# EAGLE design Ninja2 (EAGLE 5.11)
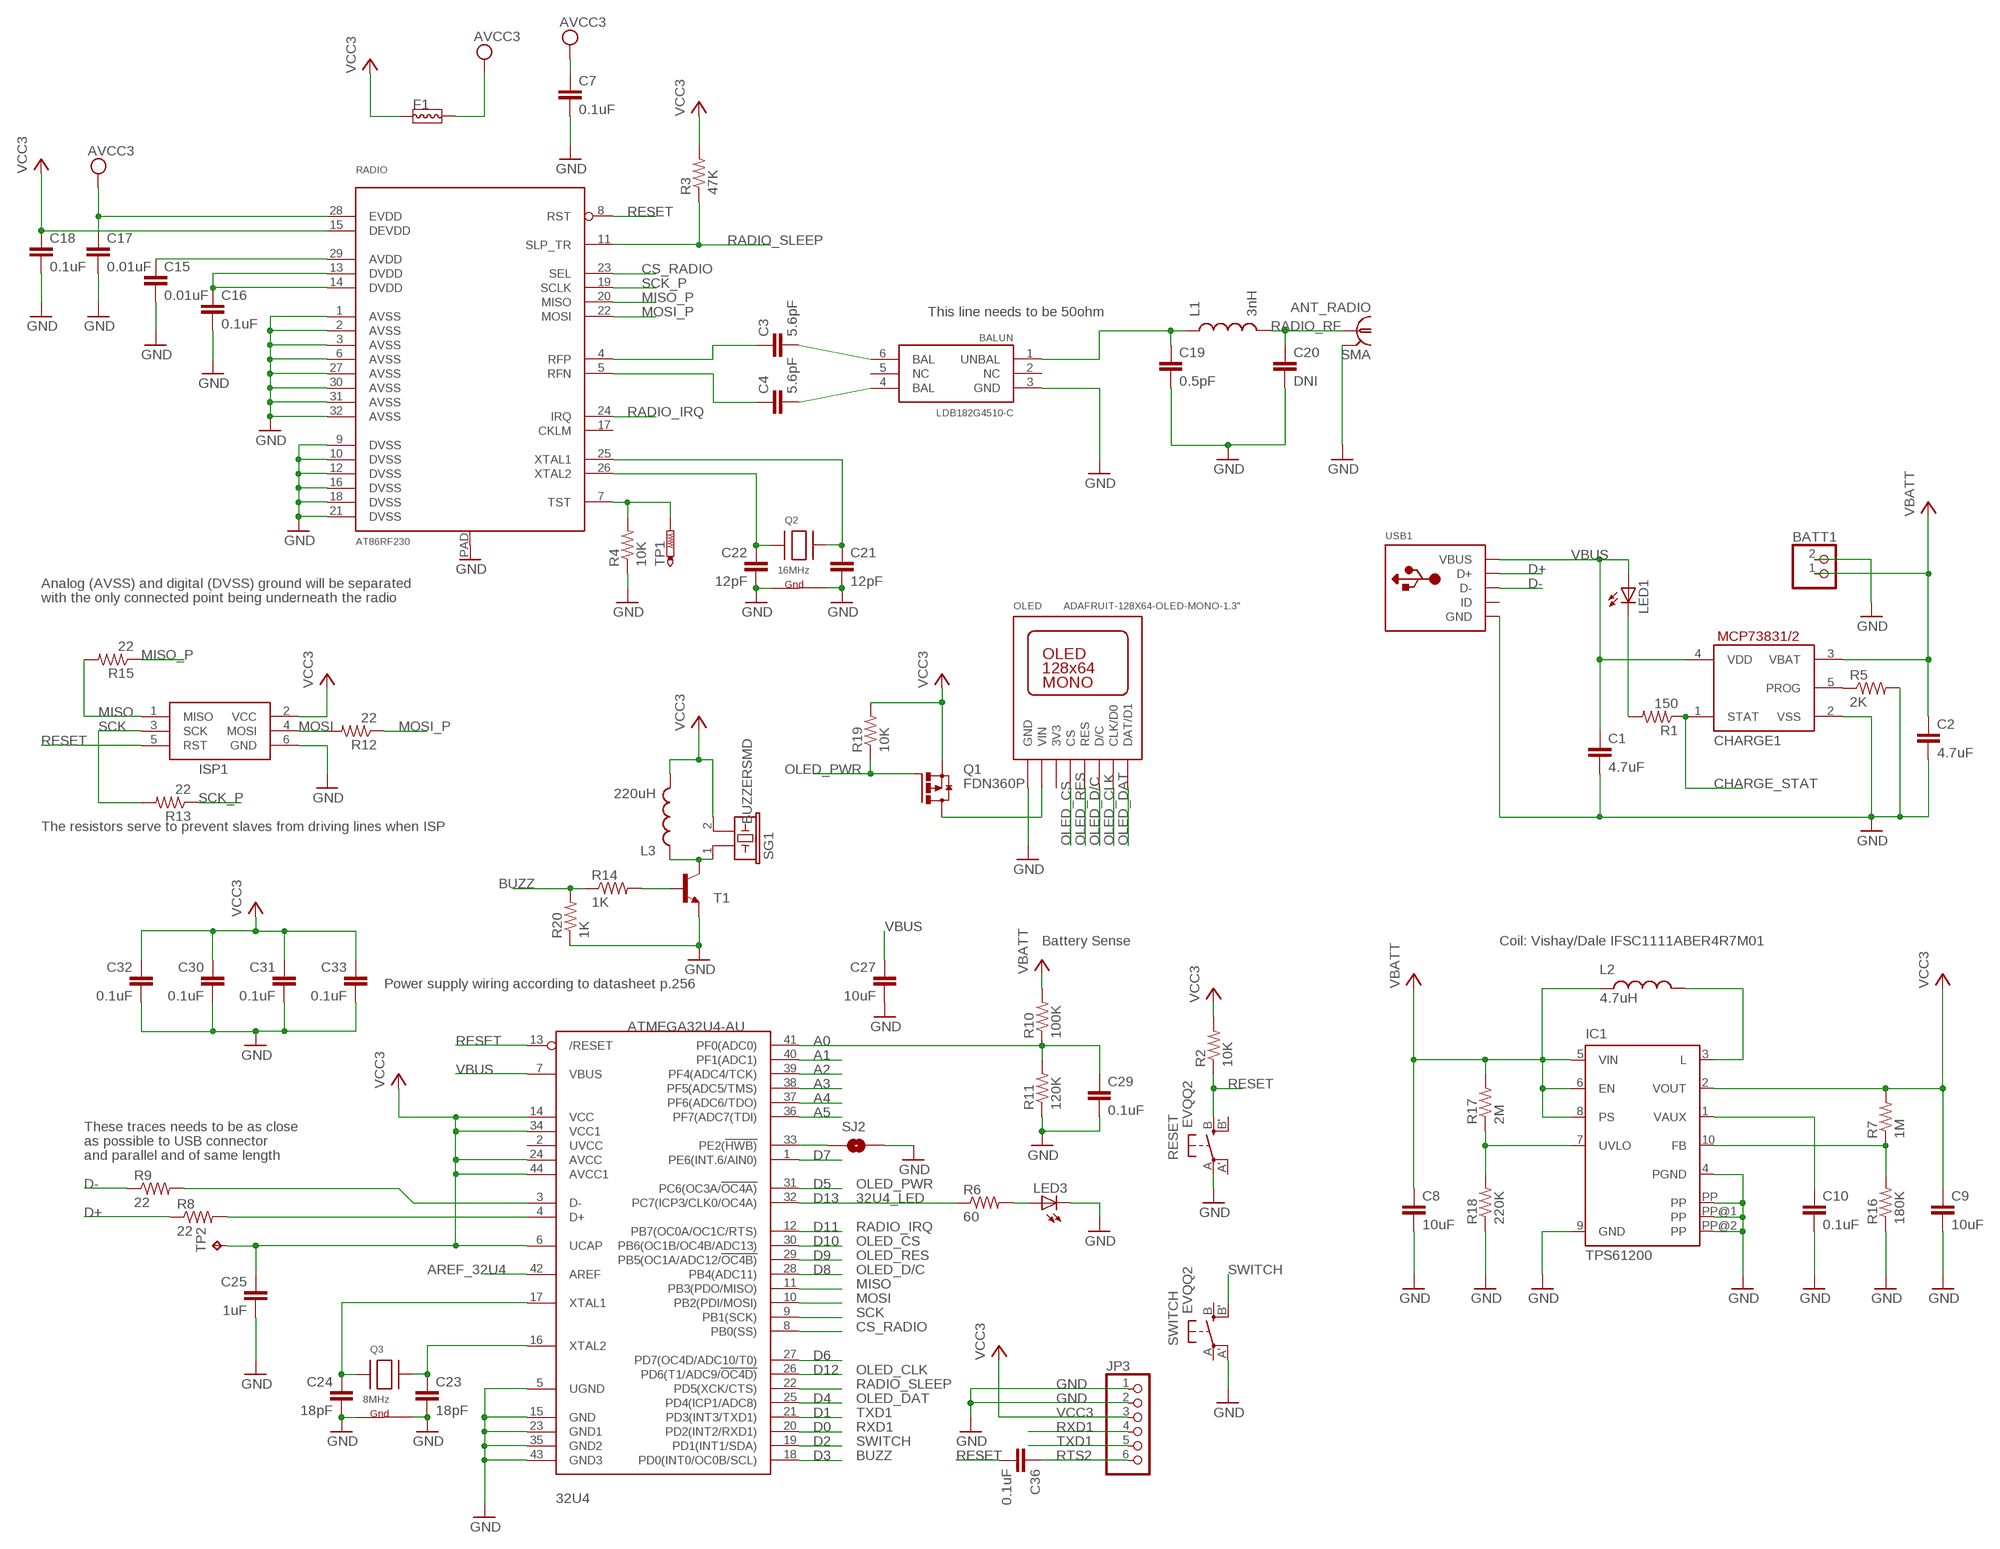
[diagram p0: schematic, sheet 1]

## Parts
32U4  ATMEGA32U4-AU  [TQFP44]
ANT_RADIO  SMA  LTI-SASF54GT  [LTI-SASF54GT]
BALUN  LDB182G4510-C  [LDB182G4510-C]
BATT1  JST_2PIN-THM  [JST-PH-2-THM]
C1  4.7uF  CAP0805  [0805]
C2  4.7uF  CAP0805  [0805]
C3  5.6pF  CAP0402-CAP  [0402-CAP]
C4  5.6pF  CAP0402-CAP  [0402-CAP]
C7  0.1uF  CAP0603-CAP  [0603-CAP]
C8  10uF  CAP0805  [0805]
C9  10uF  CAP0805  [0805]
C10  0.1uF  CAP0603-CAP  [0603-CAP]
C15  0.01uF  CAP0603-CAP  [0603-CAP]
C16  0.1uF  CAP0603-CAP  [0603-CAP]
C17  0.01uF  CAP0603-CAP  [0603-CAP]
C18  0.1uF  CAP0603-CAP  [0603-CAP]
C19  0.5pF  CAP0402-CAP  [0402-CAP]
C20  DNI  CAP0402-CAP  [0402-CAP]
C21  12pF  CAP0603-CAP  [0603-CAP]
C22  12pF  CAP0603-CAP  [0603-CAP]
C23  18pF  CAP0603-CAP  [0603-CAP]
C24  18pF  CAP0603-CAP  [0603-CAP]
C25  1uF  CAP0603-CAP  [0603-CAP]
C27  10uF  CAP0805  [0805]
C29  0.1uF  CAP0603-CAP  [0603-CAP]
C30  0.1uF  CAP0603-CAP  [0603-CAP]
C31  0.1uF  CAP0603-CAP  [0603-CAP]
C32  0.1uF  CAP0603-CAP  [0603-CAP]
C33  0.1uF  CAP0603-CAP  [0603-CAP]
C36  0.1uF  CAP0603-CAP  [0603-CAP]
CHARGE1  MCP73831/OT  [SOT23-5L]
F1  L-FERRITE-BEAD-0805  [0805]
IC1  TPS61200  [S-PDSO-N10]
ISP1  AVRISP-6  [AVRISP]
JP3  PINHD-1X6  [1X06]
L1  3nH  INDUCTOR0402  [C0402]
L2  4.7uH  INDUCTOR  [IFSC-1111AB-01]
L3  220uH  INDUCTOR1007  [1007]
LED1  LEDCHIPLED_0603  [CHIPLED_0603]
LED3  LEDCHIPLED_0603  [CHIPLED_0603]
OLED  ADAFRUIT-128X64-OLED-MONO-1.3"  [ADAFRUIT-128X64-OLED-MONO-1.3"]
Q1  FDN360P  [SUPER-SOT3]
Q2  16MHz  XTAL-4-3225  [NX3225]
Q3  8MHz  XTAL-4  [CRYSTAL-5032]
R1  150  R-US_R0805  [R0805]
R2  10K  R-US_R0603  [R0603]
R3  47K  R-US_R0603  [R0603]
R4  10K  R-US_R0603  [R0603]
R5  2K  R-US_R0603  [R0603]
R6  60  R-US_R0805  [R0805]
R7  1M  R-US_R0603  [R0603]
R8  22  R-US_R0603  [R0603]
R9  22  R-US_R0603  [R0603]
R10  100K  R-US_R0603  [R0603]
R11  120K  R-US_R0603  [R0603]
R12  22  R-US_R0603  [R0603]
R13  22  R-US_R0603  [R0603]
R14  1K  R-US_R0603  [R0603]
R15  22  R-US_R0603  [R0603]
R16  180K  R-US_R0603  [R0603]
R17  2M  R-US_R0603  [R0603]
R18  220K  R-US_R0603  [R0603]
R19  10K  R-US_R0603  [R0603]
R20  1K  R-US_R0603  [R0603]
RADIO  AT86RF230  [32QN1]
RESET  EVQQ2  [EVQ-Q2]
SG1  BUZZERSMD  [KOBITONE-254-PB501-ROX]
SJ2  SOLDERJUMPERTRACE  [SJ_2S-TRACE]
SWITCH  EVQQ2  [EVQ-Q2]
T1  BC849-NPN-SOT23-BEC  [SOT23-BEC]
TP1  PTR1B1,27  [B1,27]
TP2  TPTP15SQ  [TP15SQ]
USB1  USBMINIB  [USB-MINIB]

## Nets
32U4_LED: 32U4.32(PC7(ICP3/CLK0/OC4A)) R6.1
A1: 32U4.40(PF1(ADC1))
AREF_32U4: 32U4.42(AREF)
AVCC3: C7.1 C17.1 F1.2 RADIO.28(EVDD)
BATT_SENSE: 32U4.41(PF0(ADC0)) C29.1 R10.1 R11.2
BUZZ: 32U4.18(PD0(INT0/OC0B/SCL)) R14.1 R20.2
CHARGE_STAT: CHARGE1.1(STAT) R1.1
CS_RADIO: 32U4.8(PB0(SS)) RADIO.23(SEL)
D6: 32U4.27(PD7(OC4D/ADC10/T0))
D+: R8.1 USB1.D+
D-: R9.1 USB1.D-
GND: 32U4.5(UGND) 32U4.15(GND) 32U4.23(GND1) 32U4.35(GND2) 32U4.43(GND3) ANT_RADIO.2(GND) BALUN.3(GND) BATT1.2 C1.2 C2.2 C7.2 C8.2 C9.2 C10.2 C15.2 C16.2 C17.2 C18.2 C19.2 C20.2 C21.2 C22.2 C23.2 C24.2 C25.2 C27.2 C29.2 C30.2 C31.2 C32.2 C33.2 CHARGE1.2(VSS) IC1.4(PGND) IC1.9(GND) IC1.PP IC1.PP@1(PP) IC1.PP@2(PP) ISP1.6(GND) JP3.1 JP3.2 LED3.C OLED.GND Q2.2(G2) Q2.4(G1) Q3.2(G1) Q3.4(G2) R4.1 R5.2 R11.1 R16.1 R18.1 R20.1 RADIO.1(AVSS) RADIO.2(AVSS) RADIO.3(AVSS) RADIO.6(AVSS) RADIO.9(DVSS) RADIO.10(DVSS) RADIO.12(DVSS) RADIO.16(DVSS) RADIO.18(DVSS) RADIO.21(DVSS) RADIO.27(AVSS) RADIO.30(AVSS) RADIO.31(AVSS) RADIO.32(AVSS) RADIO.PAD RESET.A(P) SJ2.2 SWITCH.A'(P1) T1.E USB1.GND
MISO: 32U4.11(PB3(PDO/MISO)) ISP1.1(MISO) R15.2
MISO_P: R15.1 RADIO.20(MISO)
MOSI: 32U4.10(PB2(PDI/MOSI)) ISP1.4(MOSI) R12.2
MOSI_P: R12.1 RADIO.22(MOSI)
N$1: 32U4.16(XTAL2) C23.1 Q3.3(X2)
N$2: LED1.C R1.2
N$3: C10.1 IC1.1(VAUX)
N$4: CHARGE1.5(PROG) R5.1
N$5: BALUN.4(BAL) C4.2
N$6: IC1.7(UVLO) R17.1 R18.2
N$7: L3.1 SG1.1 T1.C
N$8: C16.1 RADIO.13(DVDD) RADIO.14(DVDD)
N$9: C15.1 RADIO.29(AVDD)
N$10: IC1.10(FB) R7.1 R16.2
N$11: IC1.3(L) L2.2
N$12: C21.1 Q2.3(X2) RADIO.25(XTAL1)
N$13: C22.1 Q2.1(X1) RADIO.26(XTAL2)
N$14: OLED.VIN Q1.3(D)
N$15: R14.2 T1.B
N$16: LED3.A R6.2
N$17: R4.2 RADIO.7(TST) TP1.TP
N$18: BALUN.6(BAL) C3.2
N$19: C4.1 RADIO.5(RFN)
N$20: C3.1 RADIO.4(RFP)
N$21: BALUN.1(UNBAL) C19.1 L1.1
N$22: 32U4.36(PF7(ADC7(TDI))
N$24: 32U4.17(XTAL1) C24.1 Q3.1(X1)
N$27: 32U4.3(D-) R9.2
N$28: 32U4.4(D+) R8.2
N$29: 32U4.39(PF4(ADC4/TCK))
N$30: 32U4.38(PF5(ADC5/TMS))
N$31: 32U4.37(PF6(ADC6/TDO))
N$32: 32U4.33(PE2(!HWB)) SJ2.1
N$34: 32U4.1(PE6(INT.6/AIN0))
OLED_CLK: 32U4.26(PD6(T1/ADC9/!OC4D)) OLED.CLK(CLK/D0)
OLED_CS: 32U4.30(PB6(OC1B/OC4B/ADC13)) OLED.CS
OLED_D/C: 32U4.28(PB4(ADC11)) OLED.DC(D/C)
OLED_DAT: 32U4.25(PD4(ICP1/ADC8)) OLED.DATA(DAT/D1)
OLED_PWR: 32U4.31(PC6(OC3A/!OC4A)) Q1.1(G) R19.1
OLED_RES: 32U4.29(PB5(OC1A/ADC12/!OC4B)) OLED.RST(RES)
RADIO_IRQ: 32U4.12(PB7(OC0A/OC1C/RTS)) RADIO.24(IRQ)
RADIO_RF: ANT_RADIO.1 C20.1 L1.2
RADIO_SLEEP: 32U4.22(PD5(XCK/CTS)) R3.1 RADIO.11(SLP_TR)
RESET: 32U4.13(/RESET) C36.2 ISP1.5(RST) R2.1 RADIO.8(RST) RESET.B(S)
RTS2: C36.1 JP3.6
RXD1: 32U4.20(PD2(INT2/RXD1)) JP3.4
SCK: 32U4.9(PB1(SCK)) ISP1.3(SCK) R13.2
SCK_P: R13.1 RADIO.19(SCLK)
SWITCH: 32U4.19(PD1(INT1/SDA)) SWITCH.B'(S1)
TXD1: 32U4.21(PD3(INT3/TXD1)) JP3.5
VBATT: BATT1.1 C2.1 C8.1 CHARGE1.3(VBAT) IC1.5(VIN) IC1.6(EN) IC1.8(PS) L2.1 R10.2 R17.2
VBUS: 32U4.7(VBUS) C1.1 C27.1 CHARGE1.4(VDD) LED1.A USB1.VBUS
VCC3: 32U4.6(UCAP) 32U4.14(VCC) 32U4.24(AVCC) 32U4.34(VCC1) 32U4.44(AVCC1) C9.1 C18.1 C25.1 C30.1 C31.1 C32.1 C33.1 F1.1 IC1.2(VOUT) ISP1.2(VCC) JP3.3 L3.2 Q1.2(S) R2.2 R3.2 R7.2 R19.2 RADIO.15(DEVDD) SG1.2 TP2.TP
Unconnected: 32U4.2(UVCC) BALUN.2(NC) BALUN.5(NC) OLED.3V3 RADIO.17(CKLM) RESET.A'(P1) RESET.B'(S1) SWITCH.A(P) SWITCH.B(S) USB1.ID

## Notes on the sheet
- This line needs to be 50ohm
- Analog (AVSS) and digital (DVSS) ground will be separated
- with the only connected point being underneath the radio
- The resistors serve to prevent slaves from driving lines when ISP
- Battery Sense | Coil: Vishay/Dale IFSC1111ABER4R7M01
- Power supply wiring according to datasheet p.256
- A0
- A1
- A2
- A3
- A4
- A5
- These traces needs to be as close
- as possible to USB connector
- and parallel and of same length | D7
- D5
- D13
- D11
- D10
- D9
- D8
- D6
- D12
- D4
- D1
- D0
- D2
- D3

## Power pins joined to a net without a drawn wire
GND: ANT_RADIO.3(GND) ANT_RADIO.4(GND) ANT_RADIO.5(GND)

## Library data of the parts
32U4 = adafruit:ATMEGA32U4: http://www.ladyada.net/library/eagle
ANT_RADIO = con-coax:LTI-SASF54GT: SMA vertical PCB thrue hole jack Source: Lighthorse Technologies, inc. SASF54GT.pdf; OC_FARNELL: unknown; OC_NEWARK: unknown
BALUN = Robin:LDB182G4510-C
BATT1 = adafruit:JST_2PIN: JST 2-Pin Connectors of various flavors SMT-RA (S2B-PH-SM4) 4UConnector #17311 SMT (B2B-PH-SM4) THM-RA (S2B-PH) THM (B2B-PH)
C1-C4 C7-C10 C15-C25 C27 C29-C33 C36 = SparkFun:CAP: Capacitor Standard 0603 ceramic capacitor, and 0.1" leaded capacitor.
CHARGE1 = adafruit:MCP73831: MCP73831/2 Miniature Single-Cell, Fully Integrated Li-Ion, Li-Polymer Charge Management Controllers. Nice and small simple lipoly charge controller, with adjustable current and status output (LED) http://www.ladyada.net/library/pcb/eaglelibrary.html
F1 = Discreter:L-FERRITE-BEAD
IC1 = texas:TPS6120*: LOW INPUT VOLTAGE SYNCHRONOUS BOOST CONVERTER WITH 1.3-A SWITCHES Source: http://focus.ti.com/lit/ds/symlink/tps61200.pdf; MPN: TPS61200DRCT; OC_FARNELL: 1471238; OC_NEWARK: 37M0066
ISP1 = adafruit:AVRISP: AVR ISP HEADER Standard 6 pin header for AVR programming
JP3 = pinhead:PINHD-1X6: PIN HEADER
L1 L3 = SparkFun:INDUCTOR: Inductors Basic Inductor/Choke - 0603 and 1206. Footprints are not proven and vary greatly between part numbers.
L2 = Robin:INDUCTOR
LED1 LED3 = adafruit:LED: LED OSRAM: - CHIPLED LG R971, LG N971, LY N971, LG Q971, LY Q971, LO R971, LY R971 LH N974, LH R974 LS Q976, LO Q976, LY Q976 LO Q996 - Hyper CHIPLED LW Q18S LB Q993, LB Q99A, LB R99A - SideLED LS A670, LO A670, LY A670, LG A670, LP A670 LB A673, LV A673, LT A673, LW A673 LH A674 LY A675 LS A676, LA A676, LO A676, LY A676, LW A676 LS A679, LY A679, LG A679 - Hyper Micro SIDELED® LS Y876, LA Y876, LO Y876, LY Y876 LT Y87S - SmartLED LW L88C, LW L88S LB L89C, LB L89S, LG L890 LS L89K, LO L89K, LY L89K LS L896, LA L896, LO L896, LY L896 - TOPLED LS T670, LO T670, LY T670, LG T670, LP T670 LSG T670, LSP T670, LSY T670, LOP T670, LYG T670 LG T671, LOG T671, LSG T671 LB T673, LV T673, LT T673, LW T673 LH T674 LS T676, LA T676, LO T676, LY T676, LB T676, LH T676, LSB T676, LW T676 LB T67C, LV T67C, LT T67C, LS T67K, LO T67K, LY T67K, LW E67C LS E67B, LA E67B, LO E67B, LY E67B, LB E67C, LV E67C, LT E67C LW T67C LS T679, LY T679, LG T679 LS T770, LO T770, LY T770, LG T770, LP T770 LB T773, LV T773, LT T773, LW T773 LH T774 LS E675, LA E675, LY E675, LS T675 LS T776, LA T776, LO T776, LY T776, LB T776 LHGB T686 LT T68C, LB T68C - Hyper Mini TOPLED® LB M676 - Mini TOPLED Santana® LG M470 LS M47K, LO M47K, LY M47K Source: http://www.osram.convergy.de/
OLED = Robin:ADAFRUIT-128X64-OLED-MONO-1.3"
Q1 = transistor-power:FDN360P: Single P-Channel, PowerTrench (R) MOSFET Source: http://www.fairchildsemi.com/ds/FD/FDN360P.pdf
Q2 = adafruit:XTAL-4: Classic 4-pin 3.2 x 2.5mm crystal
Q3 = Robin:XTAL-4
R1-R20 = adafruit:R-US_: RESISTOR, American symbol
RADIO = Robin:AT86RF230
RESET SWITCH = adafruit:EVQQ2: SMT 6mm switch, EVQQ2 series http://www.ladyada.net/library/eagle
SG1 = Robin:BUZZER: BUZZER Source: muRata
SJ2 = SparkFun:SOLDERJUMPER: Solder Jumper Standard SMD solder jumper. Used to automate production. Two varients : Normally Open and Normally Closed are the same, but have different paste layers. NC will have a large amount of paste and should jumper during reflow.
T1 = transistor:*-NPN-: NPN Transistror BF959 corrected 2008.03.06
TP1 = testpad:PTR1: TEST PIN
TP2 = testpad:TP: Test pad
USB1 = adafruit:USB: USB Connectors USBMINIB - Surface Mount Female Mini-B USB Connector 4UConnector: 06564 By microbuilder.eu Thru-hole RA Female Mini-B USB Connector 4UConnector: 18732 By ladyada.net

## Board
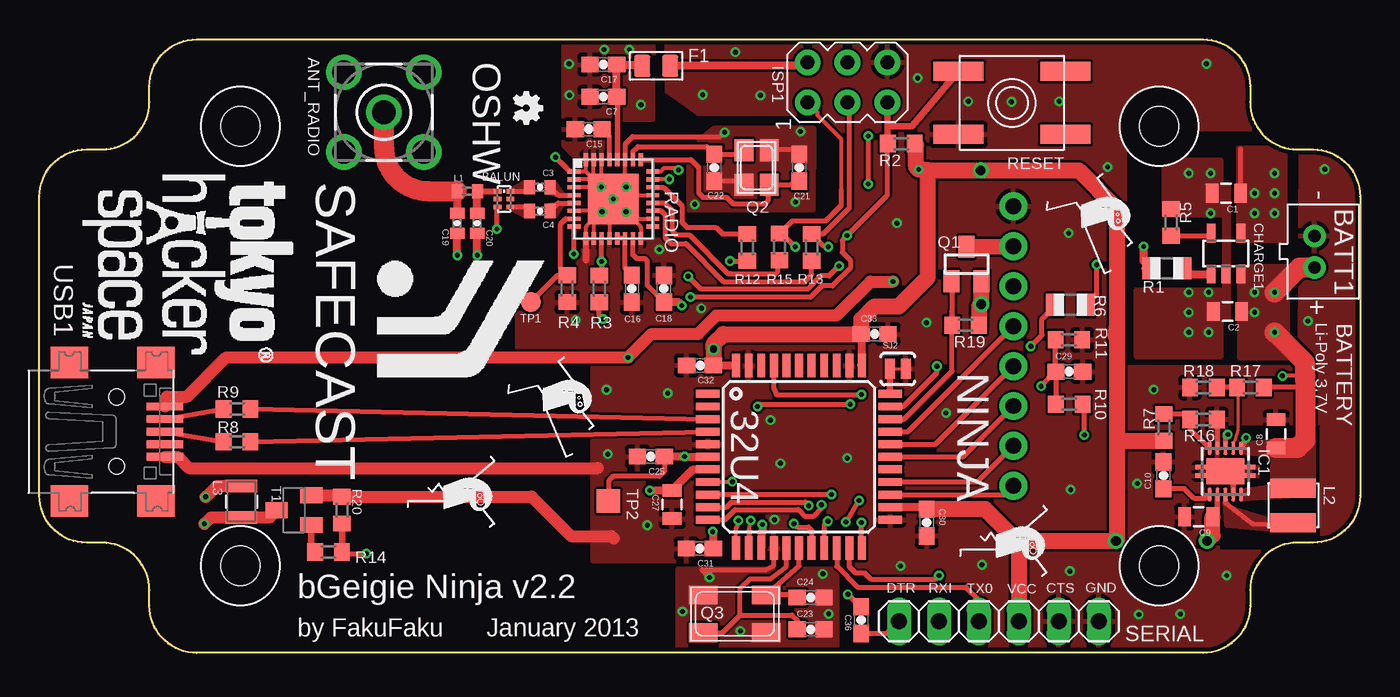
[diagram p1: board, top side]
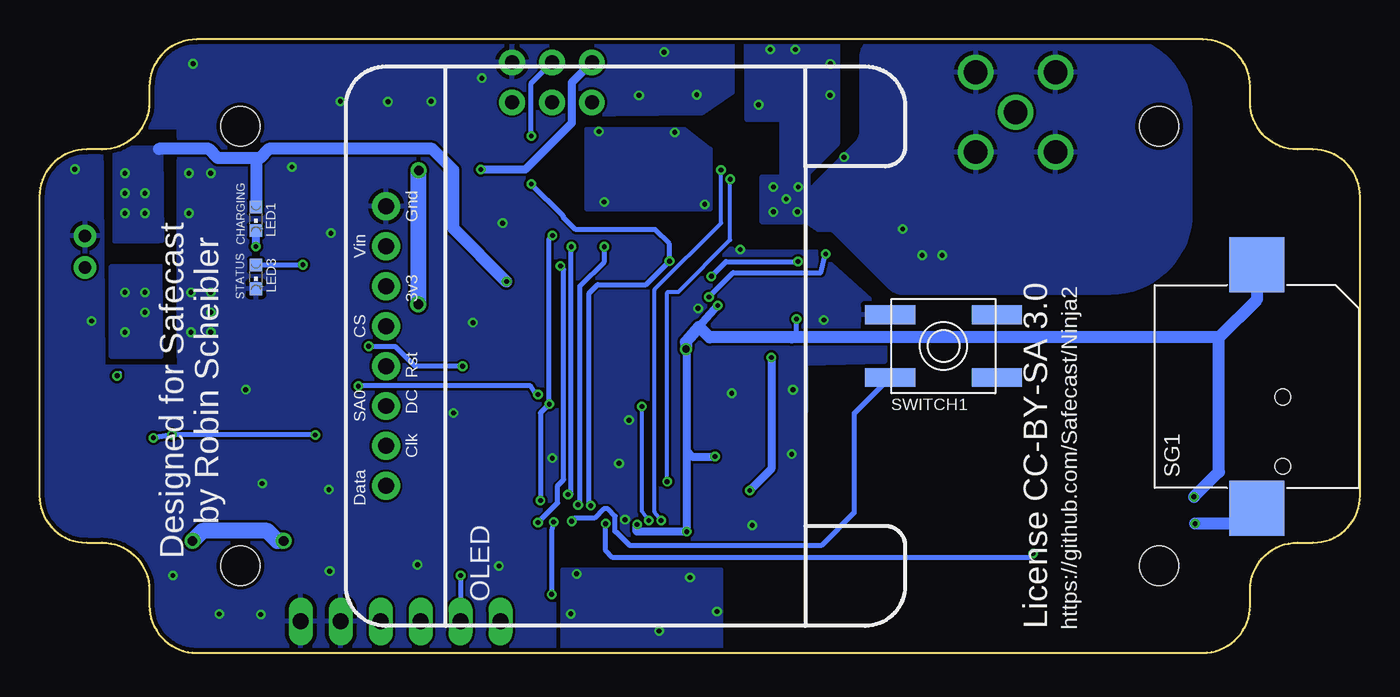
[diagram p2: board, bottom side, seen from below]

Size 84 x 39 mm. Coordinates in mm from the lower left corner, seen from the top.
Copper layers (1*16): Top 0.035mm / dielectric 1.5mm / Bottom 0.035mm
Design rules "Fusion_eagle_rule_v1.1": minimum track width 6mil, minimum drill 12mil, track to track 6mil, track to pad 6mil, pad to pad 6mil, via to via 6mil, smd to smd 0mil, copper to edge 10mil, drill to drill 10mil, minimum pad ring 10mil, minimum via ring 6mil, stop-mask expansion 2mil, vias tented up to drill 100mil, thermal gap 10mil

### Footprints (pad centres in the part's own frame; a part is rotated, then mirrored left to right if it is on the bottom)
TQFP44 = smd 1.5 x 0.5: 1 -5.8,4; 2 -5.8,3.2; 3 -5.8,2.4; 4 -5.8,1.6; 5 -5.8,0.8; 6 -5.8,0; 7 -5.8,-0.8; 8 -5.8,-1.6; 9 -5.8,-2.4; 10 -5.8,-3.2; 11 -5.8,-4; 23 5.8,-4; 24 5.8,-3.2; 25 5.8,-2.4; 26 5.8,-1.6; 27 5.8,-0.8; 28 5.8,0; 29 5.8,0.8; 30 5.8,1.6; 31 5.8,2.4; 32 5.8,3.2; 33 5.8,4 | smd 0.5 x 1.5: 12 -4,-5.8; 13 -3.2,-5.8; 14 -2.4,-5.8; 15 -1.6,-5.8; 16 -0.8,-5.8; 17 0,-5.8; 18 0.8,-5.8; 19 1.6,-5.8; 20 2.4,-5.8; 21 3.2,-5.8; 22 4,-5.8; 34 4,5.8; 35 3.2,5.8; 36 2.4,5.8; 37 1.6,5.8; 38 0.8,5.8; 39 0,5.8; 40 -0.8,5.8; 41 -1.6,5.8; 42 -2.4,5.8; 43 -3.2,5.8; 44 -4,5.8
LTI-SASF54GT = drill 1.5 pad 2.2 round: 1 0,0; 2 -2.54,2.54; 3 2.54,2.54; 4 2.54,-2.54; 5 -2.54,-2.54
LDB182G4510-C = smd 0.3 x 0.5: 1 0.5,0.4; 2 0,0.4; 3 -0.5,0.4; 4 -0.5,-0.4; 5 0,-0.4; 6 0.5,-0.4
JST-PH-2-THM = drill 0.8 pad 1.422 round: 1 1,0; 2 -1,0
0805 = smd 0.8 x 1.2: 1 -0.9,0; 2 0.9,0
0402-CAP = smd 0.7 x 0.9: 1 -0.65,0; 2 0.65,0
0603-CAP = smd 1.1 x 1: 1 -0.85,0; 2 0.85,0
SOT23-5L = smd 0.55 x 1.2: 1 -0.95,-1.3; 2 0,-1.3; 3 0.95,-1.3; 4 0.95,1.3; 5 -0.95,1.3
0805' = smd 1.016 x 1.397: 1 -0.889,0; 2 0.889,0
S-PDSO-N10 = smd 0.28 x 0.85: 1 -1,-1.475; 2 -0.5,-1.475; 3 0,-1.475; 4 0.5,-1.475; 5 1,-1.475; 6 1,1.475; 7 0.5,1.475; 8 0,1.475; 9 -0.5,1.475; 10 -1,1.475 | smd 2.4 x 1.65: PP 0,0 | smd 3.8 x 0.28: PP@1 0,0.275; PP@2 0,-0.275
AVRISP = drill 0.9 pad 1.626 round: 1 -1.27,2.54; 2 1.27,2.54; 3 -1.27,0; 4 1.27,0; 5 -1.27,-2.54; 6 1.27,-2.54
1X06 = drill 1.016 long: 1 -6.35,0; 2 -3.81,0; 3 -1.27,0; 4 1.27,0; 5 3.81,0; 6 6.35,0
C0402 = smd 0.7 x 0.9: 1 -0.65,0; 2 0.65,0
IFSC-1111AB-01 = smd 1.2 x 2.9: 1 0,0; 2 2.2,0
1007 = smd 2 x 0.8: 1 0,1; 2 0,-1
CHIPLED_0603 = smd 0.8 x 0.8: A 0,-0.75; C 0,0.75
ADAFRUIT-128X64-OLED-MONO-1.3" = drill 1.016 pad 1.778 round: 3V3 3.81,-2.54; CLK -6.35,-2.54; CS 1.27,-2.54; DATA -8.89,-2.54; DC -3.81,-2.54; GND 8.89,-2.54; RST -1.27,-2.54; VIN 6.35,-2.54
SUPER-SOT3 = smd 1 x 1.4: 1 -0.95,-1.1; 2 0.95,-1.1; 3 0,1.1
NX3225 = smd 1.4 x 1.2: 1 -1.1,-0.8; 2 1.1,-0.8; 3 1.1,0.8; 4 -1.1,0.8
CRYSTAL-5032 = smd 1.8 x 1.2: 1 -2,-1.2; 2 2,-1.2; 3 2,1.2; 4 -2,1.2
R0805 = smd 1.1 x 1.4: 1 -1,0; 2 1,0
R0603 = smd 1 x 1.1: 1 -0.85,0; 2 0.85,0
32QN1 = smd 0.8 x 0.27: 1 -2.5,1.75; 2 -2.5,1.25; 3 -2.5,0.75; 4 -2.5,0.25; 5 -2.5,-0.25; 6 -2.5,-0.75; 7 -2.5,-1.25; 8 -2.5,-1.75; 17 2.5,-1.75; 18 2.5,-1.25; 19 2.5,-0.75; 20 2.5,-0.25; 21 2.5,0.25; 22 2.5,0.75; 23 2.5,1.25; 24 2.5,1.75 | smd 0.27 x 0.8: 9 -1.75,-2.5; 10 -1.25,-2.5; 11 -0.75,-2.5; 12 -0.25,-2.5; 13 0.25,-2.5; 14 0.75,-2.5; 15 1.25,-2.5; 16 1.75,-2.5; 25 1.75,2.5; 26 1.25,2.5; 27 0.75,2.5; 28 0.25,2.5; 29 -0.25,2.5; 30 -0.75,2.5; 31 -1.25,2.5; 32 -1.75,2.5 | smd 3.2 x 3.2: PAD 0,0
EVQ-Q2 = smd 3.2 x 1.2: A -3.4,-2; A' 3.4,-2; B -3.4,2; B' 3.4,2
KOBITONE-254-PB501-ROX = smd 3.5 x 3.5: 1 0,0; 2 15.5,0
SJ_2S-TRACE = smd 0.635 x 1.27: 1 -0.508,0; 2 0.508,0
SOT23-BEC = smd 1 x 1.4: B -0.95,-1.1; C 0,1.1; E 0.95,-1.1
B1,27 = smd 1.27 x 1.27: TP 0,0
TP15SQ = smd 1.5 x 1.5: TP 0,0
TW5-3-9 = hole 2.5: 29.21,13.97; 29.21,-13.97; -29.21,-13.97; -29.21,13.97
USB-MINIB = smd 0.5 x 2.308: D+ 0,4.064; D- -0.8,4.064; GND 1.6,4.064; ID 0.8,4.064; VBUS -1.6,4.064 | smd 2 x 2.4: GND1 -4.4,-2; GND2 -4.4,3.5; GND3 4.4,3.5; GND4 4.4,-2 | hole 1: -2.2,1; 2.2,1

### Placement (x,y rotation side)
32U4  48.31,12.46 0 top
ANT_RADIO  21.91,34.37 270 top
BALUN  29.55,28.84 90 top
BATT1  81.09,25.51 270 top
C1  75.48,29.21 180 top
C2  75.56,21.7 180 top
C3  31.84,29.61 180 top
C4  31.84,28.08 180 top
C7  35.87,35.35 180 top
C8  78.65,13.92 90 top
C9  73.72,8.64 180 top
C10  71.49,11.28 90 top
C15  34.93,33.29 180 top
C16  37.68,23.15 270 top
C17  35.87,37.4 180 top
C18  39.73,23.15 90 top
C19  27.85,27.31 270 top
C20  26.58,27.31 270 top
C21  48.33,30.85 90 top
C22  42.92,30.85 270 top
C23  49.05,1.49 0 top
C24  49.05,3.52 0 top
C25  38.9,12.48 180 top
C27  40.24,9.43 270 top
C29  65.5,17.87 0 top
C30  56.43,8.28 270 top
C31  42.01,6.63 180 top
C32  42.02,18.27 180 top
C33  53.12,20.26 0 top
C36  52.27,2.08 90 top
CHARGE1  75.46,25.38 0 top
F1  [0805']  39.23,37.32 180 top
IC1  75.42,11.54 0 top
ISP1  51.39,36.27 90 top
JP3  61.02,2 180 top
L1  27.21,29.35 180 top
L2  79.74,10.47 270 top
L3  12.86,9.61 180 top
LED1  70.22,27.59 180 bottom
LED3  70.22,23.9 180 bottom
OLED  64.5,19.5 90 bottom
Q1  58.96,24.71 0 top
Q2  45.61,30.85 270 top
Q3  44.23,2.48 180 top
R1  71.7,24.44 180 top
R2  54.82,32.37 0 top
R3  35.6,23.14 270 top
R4  33.57,23.15 90 top
R5  71.98,27.36 90 top
R6  65.57,22.12 0 top
R7  71.51,14.33 270 top
R8  12.58,13.42 0 top
R9  12.58,15.5 0 top
R10  65.5,15.8 0 top
R11  65.47,19.9 180 top
R12  45.02,25.78 270 top
R13  49.12,25.78 90 top
R14  18.39,6.41 180 top
R15  47.07,25.8 90 top
R16  74.03,14.84 180 top
R17  77.02,16.87 0 top
R18  74.03,16.87 0 top
R19  58.91,20.83 0 top
R20  19.25,9.07 270 top
RADIO  36.51,28.84 0 top
RESET  61.85,34.96 0 top
SG1  6.57,9.18 90 bottom
SJ2  54.59,18.05 0 top
SWITCH  26.5,19.5 180 bottom
T1  16.2,9.07 90 top
TP1  31.25,22.29 270 top
TP2  36.19,9.65 0 top
U$1  [NINJA-PIC2]  65.09,29 270 top
U$2  [NINJA-PIC]  59.69,8.17 270 top
U$3  [THS]  -0.18,34.31 270 top
U$4  [SAFECAST_LOGO_SMALL_NOTEXT]  21.33,25.05 270 top
U$5  [OSHW_FILLX70_NOTEXT]  30.19,35.62 270 top
U$6  [NINJA-PIC2]  30.85,17.35 270 top
U$7  [NINJA-PIC]  24.55,11.27 270 top
U$8  [TW5-3-9]  42,19.5 0 top
USB1  3.92,14.06 270 top

### Tracks (layer width: path | path; a pad name or v marks a point on that pad's centre or on a via)
32U4_LED  (via drill 0.3)
  Top 0.305: 32U4.32 54.95,15.66 57.08,17.79 v57.08,18.22 | v63.05,19.49 63.76,20.2 63.76,21.22 64.57,22.03 R6.1
  Bottom 0.305: v57.08,18.22 60.1,18.22 61.35,19.46 63.02,19.46 v63.05,19.49
AVCC3
  Top 0.305: RADIO.28 | C7.1 36.76,35.39
  Top 0.356: 36.76,37.36 C17.1 | 38.27,37.4 F1.2 | C7.1 36.76,35.31 RADIO.28
  Top 0.508: C17.1 38.27,37.4 | 36.76,37.36 36.72,37.33 C7.1
BATT_SENSE  (via drill 0.3)
  Top 0.305: 64.62,17.9 R11.2 | 64.62,17.9 C29.1 R10.1 | 64.62,17.9 63.71,16.99 v63.71,16.95 | v52.28,16.42 46.87,16.42 46.71,16.78 32U4.41
  Bottom 0.305: v63.71,16.95 63.69,16.98 52.76,16.98 52.41,16.42 v52.28,16.42
BUZZ  (via drill 0.3)
  Top 0.305: 32U4.18 49.11,7.8 48.93,7.98 48.22,7.98 v47.99,8.21 | v20.81,6.31 19.35,6.31 R14.1
  Top 0.406: R14.1 R20.2 arc-45 R20.2
  Bottom 0.305: v47.99,8.21 47.99,6.51 47.53,6.05 21.07,6.05 v20.81,6.31
CHARGE_STAT
  Top 0.508: CHARGE1.1 73.06,24.08 R1.1
CS_RADIO  (via drill 0.3)
  Top 0.254: RADIO.23 40,30.09 v40.06,30.11 | 32U4.8 44.06,10.86 v44.08,10.88
  Bottom 0.254: v44.08,10.88 44.08,22.89 44.03,22.94 43.37,22.94 40.06,26.25 v40.06,30.11
D+
  Top 0.305: USB1.D+ R8.1
D-
  Top 0.305: USB1.D- R9.1
GND  (via drill 0.3)
  Top 0.254: 36.26,28.29 36.26,28.49 arc-45 36.33,28.67 RADIO.PAD | 36.26,28.29 RADIO.12 | RADIO.18 arc-45 39,27.6 38.99,27.6 37.85,27.6 arc-45 37.68,27.68 RADIO.PAD | RADIO.16 38.26,26.99 arc45 38.18,27.17 RADIO.PAD | RADIO.9 34.76,26.99 arc-45 34.83,27.17 RADIO.PAD | RADIO.6 35.65,28.09 arc45 35.83,28.17 RADIO.PAD | RADIO.10 35.26,28.84 RADIO.PAD | RADIO.3 35.76,29.59 RADIO.PAD | 34.76,30.59 RADIO.1 | RADIO.2 35.26,30.09 RADIO.PAD | 34.76,30.59 RADIO.32 | RADIO.PAD 34.76,30.59 | RADIO.21 36.76,29.09 RADIO.PAD | RADIO.31 35.26,29.29 35.76,28.79 | RADIO.27 37.26,29.59 RADIO.PAD | 35.76,28.79 RADIO.30 | 36.26,28.29 35.76,28.79 | Q2.4 47.07,32 | Q2.2 44.96,30.3
  Top 0.305: RADIO.1 33.74,30.59 v32.82,31.51 | RADIO.27 37.27,31.36 37.27,32.35 37.73,32.81 43.31,32.81 v43.58,33.08 | C21.2 48.03,32 47.07,32 | Q2.2 44.56,30 C22.2 | IC1.9 74.92,14.79 R16.1 | v29.1,26.94 29.1,28.34 BALUN.3 | v42.62,4.79 42.15,5.29 46.21,5.29 46.71,5.54 32U4.15
  Top 0.356: IC1.4 75.92,10.76 IC1.PP@2
  Top 0.406: 34.76,24.94 RADIO.9
  Top 0.508: Q3.2 42.23,3.83 | v27.85,25.27 C19.2 | v26.58,25.27 C20.2
  Top 0.762: USB1.GND 8.79,12.46 9.51,11.74 35.52,11.74 | T1.E 19.16,10.02 R20.1 31.32,9.93 33.81,7.42 36.38,7.42 36.53,7.27
  other vias: 74.36,22.92 74.49,30.48 74.49,27.94 73.09,20.38 74.36,20.38 73.09,21.65 73.09,22.92 73.09,30.48 48.41,33.13 38.26,34.84 37.52,38.35 35.92,38.35 33.69,37.44 33.71,35.45 42.19,35.48 37.32,28.03 35.79,28.03 36.51,28.84 37.32,29.61 35.74,29.61 70.87,16.73 40.9,2.63 50.2,2.48 49.83,5.02 44.58,1.38 41.68,28.51 48.08,28.66 69.92,2.44 72.56,2.47 75.5,4.91 39.97,16.5 34.1,21.16 69.82,10.76 39.43,25.64 54.54,27.31 61.82,35.03 44.26,38.19 67.94,30.88 57.66,15.25 56.42,20.99 36.07,16.72 46.5,14.79 47.13,12.04 51.38,12.37 42.11,21.9 46.75,8.46 36.15,12.63 38.66,8.11 59.95,5.6 54.77,5.52 65.54,5.19 65.59,10.37 65.46,26.68 80.68,21.09 81.74,30.74 74.22,37.45 64.85,35.06 59.08,35.06 55.85,36.53 45.86,35.44
  pour Bottom (isolate 0.305): 75.13,43.59 75.13,18.8 69.79,18.8 69.79,33.41 69.82,35.11
  pour Top (no thermals): 75.61,29.77 75.61,21.19 75.13,21.19 75.13,18.8 69.77,18.8 69.77,23.09 75.38,23.09 75.38,27.82 71.54,27.82 71.54,31.35 75.13,31.35 75.13,29.77
  pour Top (no thermals): 41.3,28.16 49.22,28.16 49.27,33.34 42.87,33.34 41.3,32.07
  pour Top: 39.02,40.7 38.99,33.87 37.17,33.87 36.05,32.76 36.05,31.49 35.9,31.33 34.27,31.33 33.36,32.25 33.36,38.9 33.56,40.7
  pour Bottom: 38.03,27.37 38.03,30.27 36.76,30.27 36.76,33.87 38.99,33.87 39.02,40.7 33.25,40.7 33.25,32.35 35.13,30.47 35.13,29.61 34.68,29.61 34.68,29.71 32.05,32.33 arc-45 31.68,33.23 31.68,37.87 arc91 30.39,39.15 15.93,39.24 arc90 10.82,34.16 10.82,27.98 arc90 15.9,22.9 29.02,22.9 arc45 29.92,23.27 33.51,26.86 34.44,26.89 35.18,27.37
  pour Top: 31.39,22.05 16.71,22.25 31.41,22.14 34.73,26.25 41.33,26.25 41.79,25.8
  pour Top (no thermals): 40.62,-0.14 40.62,5.35 50.68,5.35 50.68,-0.34 40.83,-0.34
  pour Bottom: 50.68,5.32 40.67,5.3 40.67,-0.34 50.68,-0.32
  pour Bottom: 49.17,28.21 49.17,33.29 42.97,33.29 41.35,32.02 41.35,28.21
  pour Top: 35.17,18.55 35.18,5.82 39.81,5.87 51.36,5.87 51.26,-1.91 85.02,-2.05 85.25,6.35 85.02,14.33 81.57,14.33 81.59,6.4 74.94,6.43 74.94,10.93 77.45,10.93 77.45,12.09 75.24,12.09 75.24,14.63 85.02,14.61 85.13,33.28 80.22,33.28 80.15,18.11 69.05,18.11 69.05,33.3 85.1,33.3 85.1,41.58 84.97,41.58 39.87,40.03 39.92,35.69 41.87,34.29 50.2,34.29 50.2,27.15 41.52,27.26 39.76,25.5 34.46,25.5 30.39,21.44 30.4,18.58
  pour Bottom: 30.21,18.54 30.21,18.54 30.21,21.6 34.53,25.45 39.76,25.45 41.42,27.1 50.13,27.15 50.2,33.28 50.18,34.24 41.82,34.34 39.92,35.64 39.92,40.29 39.97,40.34 86.11,40.65 86.01,33.46 75.12,33.46 75.12,18.19 79.94,18.14 80.07,33.2 86.55,33.2 86.42,18.19 86.37,18.19 86.37,-2.69 51.26,-2.39 51.26,5.8 39.83,5.8 35.31,5.74 35.25,18.41
MISO  (via drill 0.3)
  Top 0.254: ISP1.1 49.49,34.36 49.49,34.16 51,32.65 51,29.42
  Top 0.305: R15.2 47.02,26.7 | 51,29.42 51,28.44 50.02,27.46 47.88,27.46 R15.2 | R15.2 47.23,26.65 v48.06,25.81 | 32U4.11 43.61,8.46 44.26,9.1 48.27,9.1 48.67,8.7 49.26,8.7 49.74,9.18 v49.74,9.41
  Bottom 0.305: v48.06,25.81 48.06,24.88 49.61,23.32 49.61,9.53 v49.74,9.41
MISO_P
  Top 0.305: RADIO.20 39.77,28.59 40.27,28.09 40.27,26.77 40.48,26.57 41.34,26.57 43.8,24.11 43.92,24.11 46.82,24.09 46.97,24.24 46.97,24.86 R15.1
MOSI  (via drill 0.3)
  Top 0.305: R12.2 44.99,24.9 v43.92,24.9 | v48.93,9.36 48.7,9.58 44.03,9.58 43.7,9.26 32U4.10 | v52.71,29.8 v52.71,32.85
  Bottom 0.305: v52.71,29.8 50.68,27.77 50.68,27.69 49.89,26.91 44.84,26.91 43.92,25.99 v43.92,24.9 45.42,23.4 48.5,23.4 49.03,22.87 49.03,9.48 48.93,9.38 v48.93,9.36 | v52.71,32.85 52.71,36.22 ISP1.4
MOSI_P
  Top 0.305: RADIO.22 39.69,29.59 40.86,28.43 40.86,27.38 41.19,27.05 43.02,27.05 43.44,26.63 R12.1
N$1
  Top 0.305: 44.57,2.4 44.57,4.09 45.19,4.71 46.49,4.71 47.51,5.47 32U4.16 | Q3.3 43.45,1.28 44.57,2.4 | C23.1 48.2,2.06 47.87,2.4 44.57,2.4
N$2  (via drill 0.3)
  Top 0.305: R1.2 70.22,24.44
  Top 0.508: v70.23,25.84 70.23,24.91 R1.2
  Bottom 0.508: LED1.C v70.22,25.84 v70.23,25.84
N$3
  Top 0.305: C10.1 72.82,10.43 73.42,9.83 74.2,9.83 IC1.1
N$4
  Top 0.305: CHARGE1.5 74.51,26.51 R5.1
N$5
  Top 0.305: BALUN.4 30.93,28.34 C4.2
  pour Top (no thermals): 29.78,28.25 30.87,27.69 30.87,28.48 29.78,28.42
N$6
  Top 0.203: 76.13,16.83 R17.1 76.26,16.87 76.26,14.15 76.06,13.52 75.92,13.38 IC1.7
  Top 0.305: R17.1 R18.2
N$7  (via drill 0.3)
  Top 0.762: v10.5,8.21 v10.51,8.2 10.92,8.61 L3.1 14.65,8.61 T1.C
  Bottom 0.762: v10.5,8.21 7.03,8.21 SG1.1
N$8
  Top 0.305: RADIO.13 RADIO.14 37.26,24.43 C16.1
N$9
  Top 0.305: RADIO.29 36.26,32.81 C15.1
N$10
  Top 0.305: R7.1 72.83,15.18 R16.2 73.18,14.26 IC1.10
N$11
  Top 0.305: IC1.3 75.42,9.55 77.15,8.21 79.76,8.11 L2.2
  pour Top (no thermals): 75.73,9.22 78.34,8.44 78.37,7.83 75.52,8.08 75.42,9.58
N$12
  Top 0.254: 48.33,30.31 C21.1
  Top 0.305: 48.33,30.31 47.77,29.75 Q2.3 46.37,29.7 46.37,28.78 46.14,28.55 44.11,28.55 43.7,28.96 42.2,28.96 41.92,29.24 41.92,30.86 41.44,31.34 RADIO.25
N$13
  Top 0.305: Q2.1 44.56,31.7 C22.1 42.44,32.18 38.06,32.18 37.76,31.88 RADIO.26
N$14
  Top 1.016: Q1.3 OLED.VIN
N$15
  Top 0.406: T1.B 17.3,7 arc45 R14.2
N$16  (via drill 0.3)
  Top 0.305: R6.2 67.24,22.79 v67.24,24.67
  Bottom 0.305: v67.24,24.67 67.27,24.65 LED3.A
  Bottom 0.508: LED3.A
N$17
  Top 0.305: RADIO.7 33.48,27.59 33.16,27.27 33.16,24.41 R4.2 32.96,24 TP1.TP
N$18
  Top 0.305: BALUN.6 30.93,29.34 C3.2
  pour Top (no thermals): 29.78,29.44 30.87,30 30.87,29.21 29.78,29.26
N$19
  Top 0.305: C4.1 33,28.59 RADIO.5
  pour Top (no thermals): 32.2,28.53 33.03,28.68 33.36,28.5 32.83,27.69 32.2,28.48
N$20
  Top 0.305: C3.1 33,29.09 RADIO.4
  pour Top (no thermals): 32.2,29.19 32.98,29.01 33.36,29.19 32.81,30
N$21
  Top 0.33: 29.15,29.35 BALUN.1
  Top 0.381: L1.1 29.15,29.35
  Top 0.508: C19.1 L1.1
N$24
  Top 0.305: 48.08,3.65 C24.1 48.05,3.68 Q3.1 46.21,3.68 48.31,5.52 32U4.17
N$27
  Top 0.305: R9.2 32U4.3
N$28
  Top 0.305: R8.2 32U4.4
N$32
  Top 0.406: 32U4.33 54.08,16.49 SJ2.1
OLED_CLK
  Top 0.305: 32U4.26 59.67,10.86 OLED.CLK
OLED_CS
  Top 0.305: 32U4.30 55.25,14.06 OLED.CS
OLED_D/C
  Top 0.305: 32U4.28 58.73,12.46 OLED.DC
OLED_DAT
  Top 0.305: 32U4.25 61.41,10.06 OLED.DATA
OLED_PWR
  Top 0.305: 32U4.31 54.99,14.86 58.05,17.91 58.05,20.82 R19.1 | R19.1 58.05,21.73 | R19.1 58.06,23.57 Q1.1
OLED_RES
  Top 0.305: 32U4.29 56.99,13.26 OLED.RST
RADIO_IRQ  (via drill 0.3)
  Top 0.254: RADIO.24 39.51,30.59 39.71,30.79 40.55,30.79 v40.65,30.69 | 32U4.12 44.31,7.94 44.38,8.01 v44.46,8.41
  Bottom 0.254: v40.65,30.69 40.65,27.31 44.86,23.1 44.86,8.95 v44.46,8.41
RADIO_RF
  Top 0.508: L1.2 26.56,27.98 C20.1
  Top 1.27: L1.2 24.72,29.35 arc-90 21.92,32.16 21.91,32.16 ANT_RADIO.1
RADIO_SLEEP  (via drill 0.3)
  Top 0.305: 35.74,26.33 RADIO.11 v35.76,24.88 35.76,24.14 R3.1 | 32U4.22 52.28,6.69 v52.28,8.29 | v50.86,24.59 50.22,23.96 49.69,23.96 48.85,23.12 42.07,23.12 v41.26,23.93 41.28,23.93
  Bottom 0.305: v52.28,8.29 51.04,9.53 51.04,10.62 50.66,11.01 50.66,24.37 50.86,24.57 v50.86,24.59 | 40.32,24.88 40.34,24.88 | v41.26,23.93 40.32,24.88 | 40.32,24.88 v35.76,24.88
RESET  (via drill 0.3)
  Top 0.254: v45.24,8.41 45.12,7.78 45.17,7.73
  Top 0.305: 53.93,32.4 53.93,29.09 v51.37,26.53 51.06,26.22 51.06,25.46 51.57,24.95 51.57,24.44 50.45,23.32 49.77,23.32 49.03,22.59 41.44,22.59 v41.41,22.61 | v33.99,25.36 34.01,26.11 RADIO.8 | 32U4.13 45.17,6.72 45.17,7.73 | v45.68,15.65 45.83,15.81 v51.57,15.81 | C36.2 52.21,2.93 v51.42,3.72 | v51.29,8.31 51.75,9.05 v52.13,9.69
  Top 0.406: R2.1 53.93,32.4 53.93,33.48 | 53.93,33.48 ISP1.5 | RESET.B 55.49,33.48 53.93,33.48
  Bottom 0.254: v45.68,15.65 45.68,9.03 v45.24,8.41
  Bottom 0.305: v41.41,22.61 41.41,22.64 39.89,24.16 34.3,24.16 v33.99,25.36 | v51.37,26.53 51.57,26.32 v51.57,15.81 52.13,15.25 v52.13,9.69 | v51.42,3.72 51.42,7.81 v51.29,8.31
RTS2
  Top 0.305: JP3.6 53.9,1.23 C36.1
RXD1
  Top 0.305: JP3.4 59.77,2.02 59.77,3.33 58.94,4.17 52.03,4.17 50.71,5.49 32U4.20
SCK  (via drill 0.3)
  Top 0.305: ISP1.3 51.52,34.87 51.52,28.28 49.88,26.64 49.13,26.64 R13.2 49.94,25.81 v50.17,25.81 | v50.38,10.07 32U4.9
  Bottom 0.305: v50.17,25.81 50.17,10.09 v50.38,10.07
SCK_P
  Top 0.305: RADIO.19 39.54,28.09 39.82,27.82 39.82,26.37 40.17,26.01 41.11,26.01 43.52,23.61 48.67,23.61 49.11,24.04 49.11,24.92 R13.1
SWITCH  (via drill 0.3)
  Top 0.305: 32U4.19 49.91,8.13 v50.15,8.37
  Bottom 0.305: 50.1,8.41 v50.15,8.37 49.94,8.57 48.7,8.57 48.12,9.15 47.84,9.15 47.38,8.7 47.38,7.68 47.3,7.68 46.44,6.82 34.27,6.82 32.16,8.92 32.16,15.24 SWITCH.B'
TXD1  (via drill 0.3)
  Top 0.305: v57.21,4.91 56.98,4.68 52.89,4.68 52.51,5.06 51.93,5.06 51.51,5.48 32U4.21
  Bottom 0.305: v57.21,4.91 JP3.5
VBATT  (via drill 0.3)
  Top 0.254: v79.06,17.61 80.47,17.61 80.52,17.56
  Top 0.305: R17.2 80.5,16.87 80.53,16.84 | IC1.8 75.42,13.72 v75.58,13.87 | R10.2 66.45,15.7 v66.45,13.85
  Top 0.356: v76.74,13.67 76.52,13.1 IC1.6
  Top 0.762: C2.1 76.52,21.63
  Top 1.27: C8.1 80.01,13.02 80.53,13.54 80.53,16.84 80.52,17.56 80.5,18.43 v78.56,20.38 | BATT1.1 80.15,24.51 v78.56,22.92
  Bottom 0.254: v79.06,17.61 78.88,17.78
  Bottom 0.305: v66.45,13.85 66.47,13.87 v75.58,13.87
  Bottom 0.356: v75.58,13.87 v76.74,13.67
  other vias: 77.28,21.65 77.28,22.92
  pour Bottom: 76.34,24.49 76.27,18.83 79.42,18.83 79.42,24.57 76.27,24.59
  pour Top (no thermals): 76.32,24.57 76.32,18.75 79.39,18.75 79.39,24.54 76.47,24.54
  pour Top (no thermals): 76.41,13.29 78.55,13.47 81.01,13.41 81.01,10.06 76.46,9.76 76.46,10.32 78.42,10.6 78.47,12.53 76.44,12.73 76.44,13.26
VBUS  (via drill 0.3)
  Top 0.305: 76.4,32.04 76.4,29.21 C1.1
  Top 0.508: 32U4.7 41.57,11.66 C27.1 v38.82,10.32
  Top 0.762: USB1.VBUS 8.11,16.29 9.41,16.29 11.89,18.78 v37.45,18.78 38.95,20.28 41.89,20.28 43.06,21.45 50.68,21.45 52.84,23.61 v54.29,23.61
  Bottom 0.508: v37.45,18.78 37.45,11.69 v38.82,10.32
  Bottom 0.762: v54.29,23.61 57.67,26.98 57.67,30.69 59.01,32.04 69.4,32.04 69.98,31.45 70.21,31.45 | 70.21,31.45 72.63,31.45 73.21,32.04 76.39,32.04 76.4,32.04 | LED1.A 70.22,31.44 70.21,31.45
  other vias: 78.55,29.21 78.55,27.94 77.28,27.94 77.28,29.21 78.55,30.48
  pour Bottom: 76.19,26.22 76.24,32.09 79.22,32.09 79.22,26.17 76.42,26.19
  pour Top (no thermals): 76.27,26.19 76.27,32.11 79.22,32.11 79.22,26.19
VCC3  (via drill 0.3, 0.46, 0.61 pad 1.02)
  Top 0.305: 68.54,23.12 68.52,23.13 | C18.1 38.67,23.35 38.67,24.9 38.51,25.05 38.01,25.05 37.76,25.3 RADIO.15 | C25.1 39.74,11.53 39.43,11.21 36.48,11.21 36.2,10.93 36.2,9.66 TP2.TP | R3.2 35.6,21.46 v35.85,21.22
  Top 0.356: IC1.2 74.92,8.94 C9.1
  Top 0.508: C30.1 56.3,9.26 32U4.24 | C33.1 52.27,18.3 32U4.34 | 42.88,18.29 44.28,18.29 32U4.44 | C31.1 42.86,7.68 v42.83,7.7 | 32U4.14 45.91,7.61 45.98,7.68 v45.98,8.16 | C25.1 v41.03,12.48 41.05,12.46 32U4.6 | v40.85,22.08 40.64,22.3 C18.1 | F1.1 48.64,37.32 ISP1.2
  Top 0.762: v10.57,9.91 10.59,9.9 11.29,10.61 L3.2
  Top 1.016: v74.25,7.12 74.61,7.47 74.61,8.63 C9.1 | 68.54,13.57 68.54,7.19 v68.46,7.12 68.44,7.09 62.39,7.09 | R7.2 68.63,13.48 68.54,13.57 | 68.54,20.86 68.54,13.57 | 68.54,20.86 68.54,23.12 68.54,28.23 66.1,30.67 v59.88,30.67 56.5,30.67 | 68.54,20.86 68.44,20.17 | 56.5,30.67 v55.93,30.73 55.76,30.89 55.76,32.27 R2.2 | Q1.2 v59.91,22.16 v59.9,22.16 59.76,22.02 R19.2 | C30.1 60.15,9.13 62.19,7.09 62.39,7.09 | JP3.3 62.29,7 62.39,7.09 | 56.5,30.67 56.5,23.87 54.66,22.03 53.12,22.03 52.27,21.18 C33.1 43.5,20.26 42.88,19.64 v42.88,19.31 42.88,18.29 C32.1
  Bottom 0.305: v35.85,21.22 35.85,20.35 36.15,20.05
  Bottom 0.508: ISP1.2 50.12,36.27 50.12,33.69 53.08,30.73 v55.93,30.73 | 42.83,12.84 v42.83,7.7 46.01,7.7 46.01,8.14 v45.98,8.16 | 42.83,12.84 42.83,19.26 v42.88,19.31 | v41.03,12.48 42.48,12.48 42.83,12.84 | 42.05,20.72 v40.85,22.08
  Bottom 0.762: v42.88,19.31 42.88,19.77 42.05,20.72 41.38,20.05 36.15,20.05 8.98,20.05 | 8.98,20.05 6.55,22.48 6.55,24.67 SG1.2 | 8.98,20.05 8.98,11.51 v10.57,9.91
  Bottom 1.016: v59.9,22.16 59.9,30.64 v59.88,30.67 | v68.46,7.12 68.86,7.12 69.5,7.75 73.61,7.75 v74.25,7.12

### Text on the board
tPlace: OSHW | RESET | SAFECAST | Q2 | Li-Poly 3.7V | BATTERY | NINJA | DTR | RXI | TX0 | VCC | CTS | GND | bGeigie Ninja v2.2 | by FakuFaku | January 2013 | SERIAL
bPlace: CHARGING | STATUS | SWITCH1 | by Robin Scheibler | Designed for Safecast | License CC-BY-SA 3.0 | https://github.com/Safecast/Ninja2